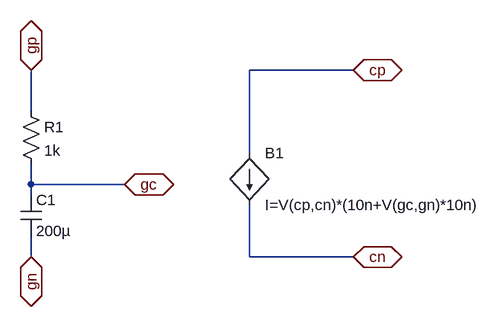
[diagram p0: schematic capteur_graphite_A.asc]
capteur_graphite_A.asc, the LTspice schematic file:
Version 4
SHEET 1 880 680
WIRE 480 32 320 32
WIRE -16 96 -16 32
WIRE 320 160 320 32
WIRE -16 208 -16 176
WIRE 128 208 -16 208
WIRE -16 224 -16 208
WIRE -16 320 -16 288
WIRE 320 320 320 240
WIRE 480 320 320 320
FLAG -16 32 gp
IOPIN -16 32 BiDir
FLAG 128 208 gc
IOPIN 128 208 BiDir
FLAG -16 320 gn
IOPIN -16 320 BiDir
FLAG 480 32 cp
IOPIN 480 32 BiDir
FLAG 480 320 cn
IOPIN 480 320 BiDir
SYMBOL res -32 80 R0
SYMATTR InstName R1
SYMATTR Value 1k
SYMBOL cap -32 224 R0
SYMATTR InstName C1
SYMATTR Value 200µ
SYMBOL bi 320 160 R0
SYMATTR InstName B1
SYMATTR Value I=V(cp,cn)*(10n+V(gc,gn)*10n)

The netlist it stands for:
* capteur_graphite_A.asc
R1 gp gc 1k
C1 gc gn 200µ
B1 cp cn I=V(cp,cn)*(10n+V(gc,gn)*10n)
.backanno
.end